# Altium project cnc_handwheel_interface.PrjPcb
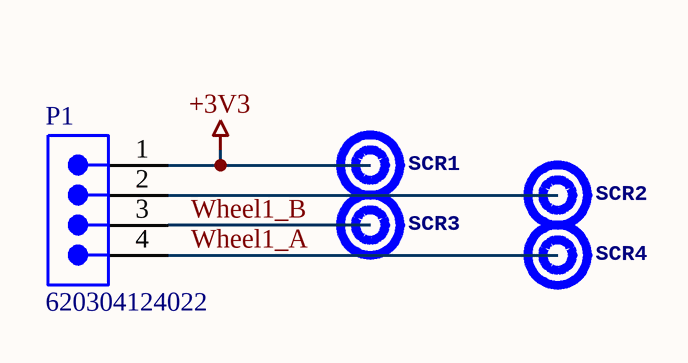
[diagram p0: uc.SchDoc]
NameStep: epi_cnc_tst_hrd_s3d_interface_v100; NameSch: epi_cnc_tst_hrd_sch_interface_v100; NamePnp: epi_cnc_tst_hrd_pnp_interface_v100; NamePdf3d: epi_cnc_tst_hrd_p3d_interface_v100; NamePcbmanufacturing: epi_cnc_tst_hrd_pcb_interface_v100; NameImplant: epi_cnc_tst_hrd_imp_interface_v100; NameGerber: epi_cnc_tst_hrd_gbr_interface_v100; NameBom: epi_cnc_tst_hrd_bom_interface_v100; NameAssembly: epi_cnc_tst_hrd_ass_interface_v100; Name: CNC_Handwheel_interface
2 sheets, 9 parts. Net scope: global (net labels, ports and power ports of the same name join across sheets).
Board file: interface.PcbDoc
Sheets:
  uc.SchDoc
  meca.SchDoc

## Sheet uc.SchDoc
size A3; Organization: EPI sarl; Address1: 153 rue d'Altorf; Address2: 67120; Address3: Dachstein; Address4: France; SheetNumber: 1; SheetTotal: 2

### Parts
P1  620304124022  [620304124022]
SCR1  SCREW-PTH_M3  [SCREW-TCHC-M3-PTH]  (value not drawn)
SCR2  SCREW-PTH_M3  [SCREW-TCHC-M3-PTH]  (value not drawn)
SCR3  SCREW-PTH_M3  [SCREW-TCHC-M3-PTH]  (value not drawn)
SCR4  SCREW-PTH_M3  [SCREW-TCHC-M3-PTH]  (value not drawn)

### Nets
+3V3: P1.1 SCR1.1
Wheel1_A: P1.4 SCR4.1
Wheel1_B: P1.3 SCR3.1
NetP1_2: P1.2 SCR2.1

### Notes on the sheet
- Unless otherwise noted, this document contains EPI® technologies information.
- Exclusive Property of EPI®
- File :
- Size:
- Date:
- A3
- Ref :
- Sheet
- of
- Reproduction, use, disclosure or transmittal of all or any part of this document is prohibited except to the explicit approved in writing by EPI® representative.
- Project :

### Library data of the parts
P1 = CMP-1502-00662-2: NexarPartId: 18818244; Insulation: Insulated; Number of Contacts: 4; Connector Type: Male Pin; Contact Resistance: 20mΩ; Current Rating: 2A; Insulation Resistance: 1GΩ; Operating Supply Voltage: 100V; Pitch: 2mm; Voltage Rating: 125V; Gender: Male; Packaging: Tape and Reel; Number of Rows: 1; Height: 6.6mm; Width: 11.9mm; Number of Pins: 4; Contact Plating: Tin; Contact Mating Length: 3.5052mm; Flammability Rating: UL94 V-0; Color: Beige, White; Contact Gender: Male; Orientation: Vertical; Contact Material: Copper; Max Operating Temperature: 85°C; RoHS: Compliant; Number of Positions: 4; Lead Pitch: 2mm; Min Operating Temperature: -40°C; Length: 9mm; Termination: SMD/SMT; Housing Material: Nylon; REACH SVHC: Unknown; Lead Free: Lead Free; Mount: Surface Mount
SCR1-SCR4 = SCREW-PTH_M3: GateName_1: G$1; SymbolName_1: SCREW; DeviceName: M3; 3DPACKAGE: NO; ENO_PN: SCR0001; INFO: Standard CHC M3; MF: GENERIC; LibraryName: screw-eno; DeviceSetName: SCREW-PTH_; Package: SCREW-TCHC-M3-PTH

## Sheet meca.SchDoc
size A3; Organization: EPI sarl; Address1: 153 rue d'Altorf; Address2: 67120; Address3: Dachstein; Address4: France; SheetNumber: 2; SheetTotal: 2
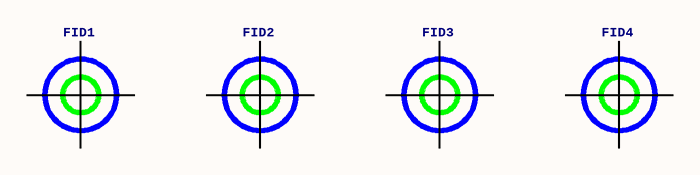
[diagram p1: meca.SchDoc]

### Parts
FID1  FIDUCIALROUND-1MM  [FID-1MM_V3]  (value not drawn)  (no BOM)
FID2  FIDUCIALROUND-1MM  [FID-1MM_V3]  (value not drawn)  (no BOM)
FID3  FIDUCIALROUND-1MM  [FID-1MM_V3]  (value not drawn)  (no BOM)
FID4  FIDUCIALROUND-1MM  [FID-1MM_V3]  (value not drawn)  (no BOM)

### Notes on the sheet
- Unless otherwise noted, this document contains EPI® technologies information.
- Exclusive Property of EPI®
- File :
- Size:
- Date:
- A3
- Ref :
- Sheet
- of
- Reproduction, use, disclosure or transmittal of all or any part of this document is prohibited except to the explicit approved in writing by EPI® representative.
- Project :

### Library data of the parts
FID1-FID4 = FIDUCIALROUND-1MM: MPN: ??; GateName_1: G$1; ENO_PN: LOC0001; INFO: no mounted; SymbolName_1: FIDUCIAL; DeviceName: ROUND-1MM; LibraryName: marker-eno; DeviceSetName: FIDUCIAL; Package: FIDUCIAL-1MM; CASE: ??